# Altium schematic sheet power.SchDoc
size A
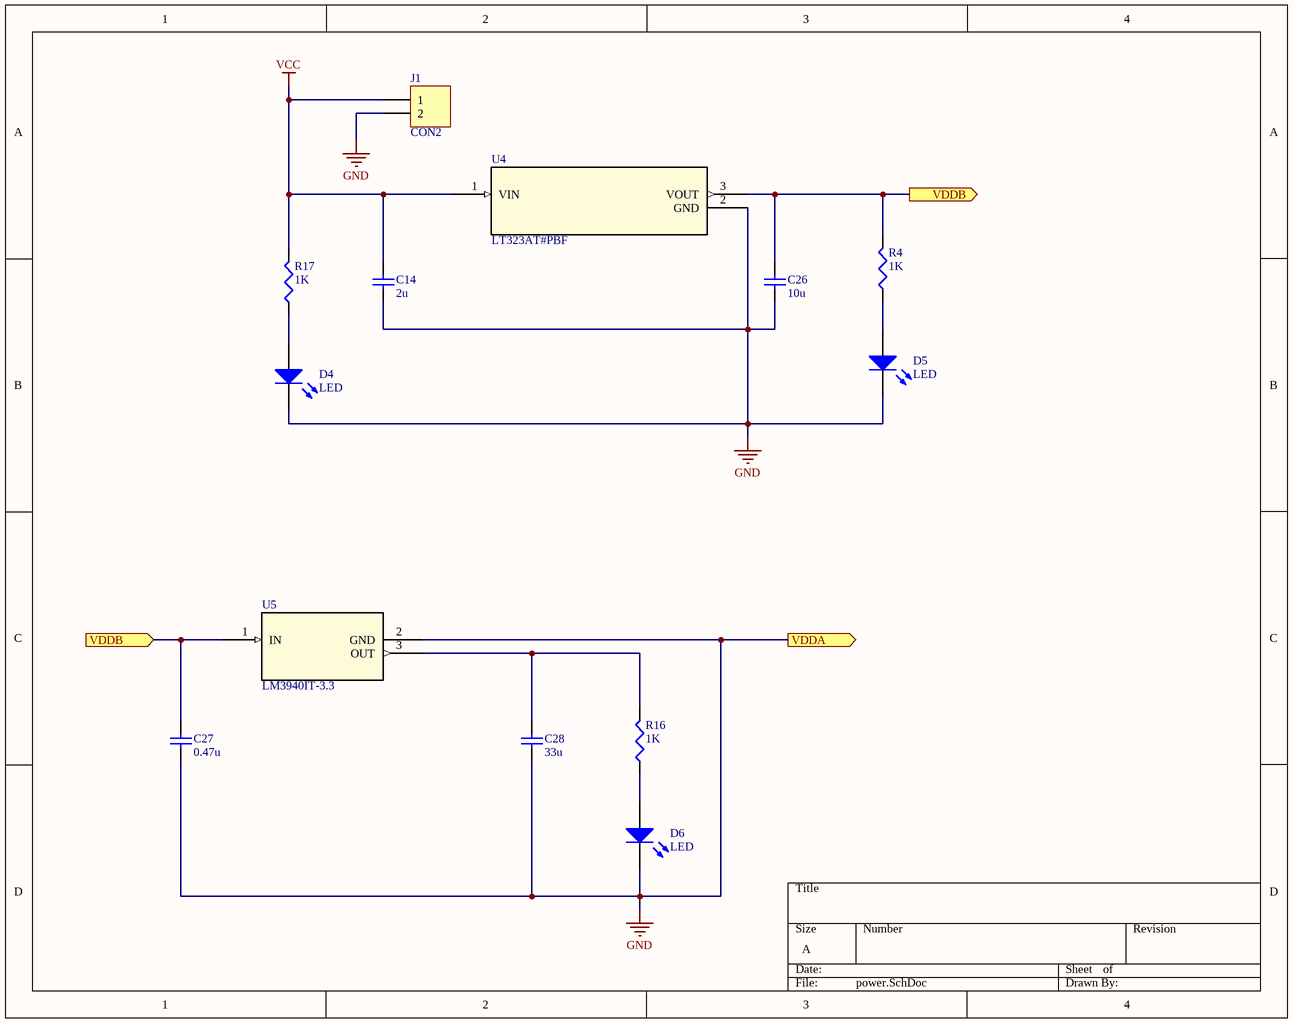
[diagram p0: power.SchDoc]

## Parts
C14  2u  [C1206]
C26  10u  [C1206]
C27  0.47u  [C1206]
C28  33u  [C1206]
D4  LED  [3.2X1.6X1.1]
D5  LED  [3.2X1.6X1.1]
D6  LED  [3.2X1.6X1.1]
J1  CON2  [HDR1X2]
R4  1K  [J1-0603]
R16  1K  [J1-0603]
R17  1K  [J1-0603]
U4  LT323AT#PBF  [TO220-3_T_LIT]
U5  LM3940IT-3.3  [T03B]

## Ports
VDDA (out), VDDB (in), VDDB (out)

## Nets
GND: C14.1 C26.1 C27.1 C28.1 D4.2(K) D5.2(K) D6.2(K) J1.2 U4.2(GND) U5.2(GND) ; port VDDA
VCC: C14.2 J1.1 R17.2 U4.1(VIN)
VDDB: C26.2 C27.2 R4.2 U4.3(VOUT) U5.1(IN) ; port VDDB
NetC28_2: C28.2 R16.2 U5.3(OUT)
NetD4_1: D4.1(A) R17.1
NetD5_1: D5.1(A) R4.1
NetD6_1: D6.1(A) R16.1

## Library data of the parts
C14 C26-C28 = Cap Semi: Capacitor (Semiconductor SIM Model); Value: 100pF; Published: 8-Jun-2000; LatestRevisionDate: 29-May-2009; LatestRevisionNote: IPC-7351 Footprint Added.; PackageReference: C1206; Publisher: Altium Limited; PackageDescription: Chip Capacitor
D4-D6 = LED2: Typical RED, GREEN, YELLOW, AMBER GaAs LED; Published: 8-Jun-2000; LatestRevisionDate: 17-Jul-2002; LatestRevisionNote: Re-released for DXP Platform.; PackageVersion: Feb-2002; PackageReference: 3.2X1.6X1.1; Publisher: Altium Limited; PackageDescription: SM LED; 2 Flat Leads
J1 = Header 2: Header, 2-Pin; LatestRevisionDate: 17-Jul-2002; LatestRevisionNote: Re-released for DXP Platform.; Publisher: Altium Limited
R4 R16 R17 = Res3: Published: 8-Jun-2000; LatestRevisionDate: 29-May-2009; LatestRevisionNote: IPC-7351 Footprint Added.; PackageReference: J1-0603; Publisher: Altium Limited; PackageDescription: Chip Resistor; Value: 1K
U4 = LT323AT#PBF: No Description Available; Mfr_Name: Analog Devices / Linear Technology; Copyright: Copyright (C) 2022 Ultra Librarian. All rights reserved.; Manufacturer_Part_Number: LT323AT#PBF; Digi-Key_Part_Number_1: LT323AT#PBF-ND; RefDes: RefDes; Type: DEV
U5 = LM3940IT-3.3: No Description Available; Mfr_Name: Texas Instruments; Type: DEV; Copyright: Copyright (C) 2022 Ultra Librarian. All rights reserved.; Manufacturer_Part_Number: LM3940IT-3.3; RefDes: RefDes